# EAGLE design ATJ3315Recorder (EAGLE 6.5.0)
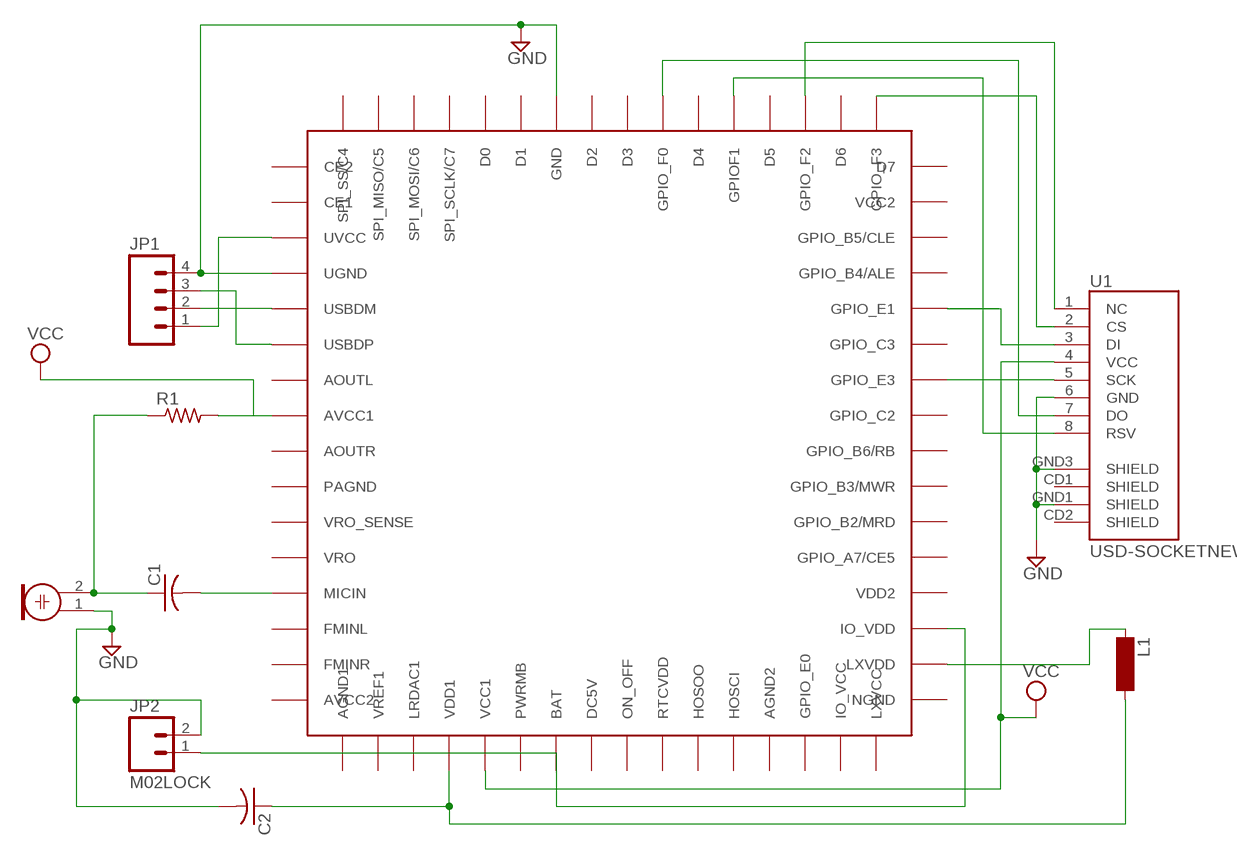
[diagram p0: schematic, sheet 1]

## Parts
C1  C-USC0201  [C0201]
C2  C-USC0201  [C0201]
JP1  M04PTH  [1X04]
JP2  M02LOCK  [1X02_LOCK]
L1  SM-1206  [SM-1206]
M1  ELECTRET_MICROPHON-WM-61A  [WM-61A]
R1  R-US_M0805  [M0805]
U1  USD-SOCKETNEW  [MICRO-SD-SOCKET-PP]
U$4  AJ3315  [64M1]

## Nets
GND: C2.2 JP1.4 JP2.2 M1.1 U1.6(GND) U1.GND1(SHIELD) U1.GND3(SHIELD) U$4.4(UGND) U$4.58(GND)
N$1: JP1.2 U$4.5(USBDM)
N$2: JP1.3 U$4.6(USBDP)
N$3: JP2.1 U$4.23(BAT) U$4.35(IO_VDD)
N$4: JP1.1 U$4.3(UVCC)
N$5: R1.2 U$4.8(AVCC1)
N$6: C1.1 M1.2 R1.1
N$7: C1.2 U$4.13(MICIN)
N$8: U1.5(SCK) U$4.42(GPIO_E3)
N$9: U1.7(DO) U$4.55(GPIO_F0)
N$10: U1.1(NC) U$4.51(GPIO_F2)
N$11: U1.2(CS) U$4.49(GPIO_F3)
N$12: U1.3(DI) U$4.44(GPIO_E1)
N$13: U1.8(RSV) U$4.53(GPIOF1)
N$14: L1.1 U$4.34(LXVDD)
N$16: C2.1 L1.2 U$4.20(VDD1)
VCC: U1.4(VCC) U$4.21(VCC1)
Unconnected: U1.CD1(SHIELD) U1.CD2(SHIELD) U$4.1(CE2) U$4.2(CE1) U$4.7(AOUTL) U$4.9(AOUTR) U$4.10(PAGND) U$4.11(VRO_SENSE) U$4.12(VRO) U$4.14(FMINL) U$4.15(FMINR) U$4.16(AVCC2) U$4.17(AGND1) U$4.18(VREF1) U$4.19(LRDAC1) U$4.22(PWRMB) U$4.24(DC5V) U$4.25(ON_OFF) U$4.26(RTCVDD) U$4.27(HOSOO) U$4.28(HOSCI) U$4.29(AGND2) U$4.30(GPIO_E0) U$4.31(IO_VCC) U$4.32(LXVCC) U$4.33(NGND) U$4.36(VDD2) U$4.37(GPIO_A7/CE5) U$4.38(GPIO_B2/MRD) U$4.39(GPIO_B3/MWR) U$4.40(GPIO_B6/RB) U$4.41(GPIO_C2) U$4.43(GPIO_C3) U$4.45(GPIO_B4/ALE) U$4.46(GPIO_B5/CLE) U$4.47(VCC2) U$4.48(D7) U$4.50(D6) U$4.52(D5) U$4.54(D4) U$4.56(D3) U$4.57(D2) U$4.59(D1) U$4.60(D0) U$4.61(SPI_SCLK/C7) U$4.62(SPI_MOSI/C6) U$4.63(SPI_MISO/C5) U$4.64(SPI_SS/C4)

## Library data of the parts
C1 C2 = rcl:C-US: CAPACITOR, American symbol
JP1 = SparkFun-Connectors:M04: Header 4 Standard 4-pin 0.1" header. Use with straight break away headers (SKU : PRT-00116), right angle break away headers (PRT-00553), swiss pins (PRT-00743), machine pins (PRT-00117), and female headers (PRT-00115). Molex polarized connector foot print use with SKU : PRT-08231 with associated crimp pins and housings. 1MM SMD Version SKU: PRT-10208
JP2 = SparkFun-Connectors:M02: Standard 2-pin 0.1" header. Use with - straight break away headers ( PRT-00116) - right angle break away headers (PRT-00553) - swiss pins (PRT-00743) - machine pins (PRT-00117) - female headers (PRT-00115) Molex polarized connector foot print use with: PRT-08233 with associated crimp pins and housings. 2.54_SCREWTERM for use with PRT-10571. 3.5mm Screw Terminal footprints for PRT-08084 5mm Screw Terminal footprints for use with PRT-08433
L1 = inductor-neosid:SM-1206: INDUCTOR SMD chip inductor; OC_FARNELL: unknown; OC_NEWARK: unknown
M1 = microphon:ELECTRET_MICROPHON-: Electret Condenser Microphone
R1 = rcl:R-US_: RESISTOR, American symbol
U1 = SparkFun-Connectors:USD-SOCKET: microSD Socket Push-push type uSD socket. Schematic element and footprint production proven. Spark Fun Electronics SKU : PRT-00127. tDoc lines correctly indicate media card edge positions when inserting (unlocked, locked, depressed).
U$4 = dissection:AJ3315

## Board
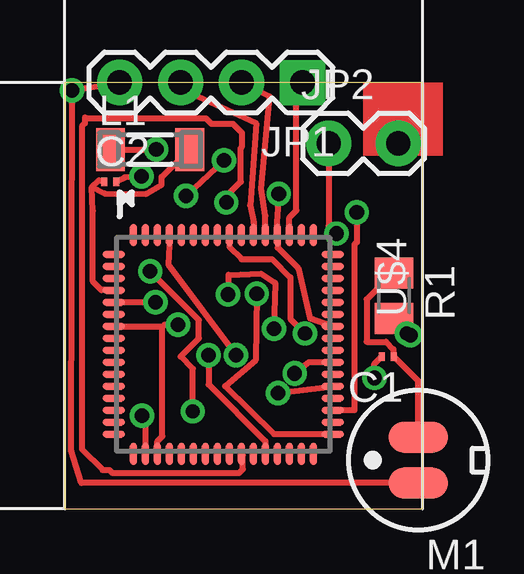
[diagram p1: board, top side]
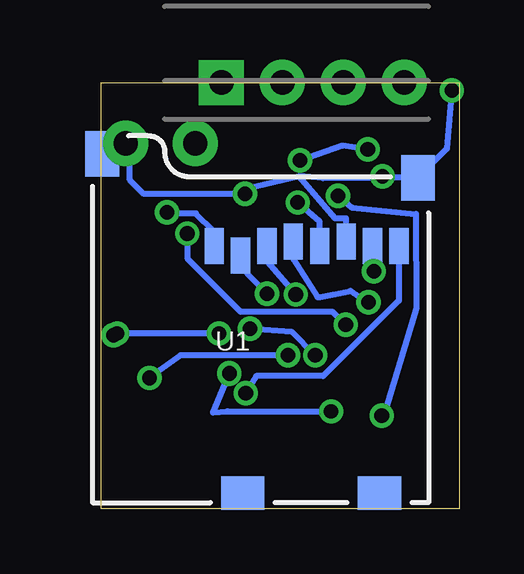
[diagram p2: board, bottom side, seen from below]

Size 14.91 x 17.77 mm. Coordinates in mm from the lower left corner, seen from the top.
Outline: 0,0 14.91,0 14.91,17.77 0,17.77 0,0
Copper layers (1*16): Top 0.035mm / dielectric 1.5mm / Bottom 0.035mm
Design rules "default *": minimum track width 10mil, minimum drill 24mil, track to track 1mil, track to pad 1mil, pad to pad 1mil, via to via 1mil, smd to smd 1mil, copper to edge 40mil, drill to drill 8mil, minimum pad ring 10mil, minimum via ring 8mil, stop-mask expansion 4mil, vias tented up to drill 0mil, thermal gap 10mil

### Footprints (pad centres in the part's own frame; a part is rotated, then mirrored left to right if it is on the bottom)
C0201 = smd 0.25 x 0.35: 1 -0.25,0; 2 0.25,0
1X04 = drill 1.016 pad 1.88 square: 1 0,0 | drill 1.016 pad 1.88: 2 2.54,0; 3 5.08,0; 4 7.62,0
1X02_LOCK = drill 1.016 pad 1.88: 1 -0.178,0; 2 2.718,0
SM-1206 = smd 1.2 x 1.8: 1 -1.65,0; 2 1.65,0
WM-61A = smd 2.5 x 1.3: 1 0,0.95; 2 0,-0.95
M0805 = smd 1.3 x 1.6: 1 -0.95,0; 2 0.95,0
MICRO-SD-SOCKET-PP = smd 0.8 x 1.5: 1 -8.94,10.7; 2 -7.84,10.3; 3 -6.74,10.7; 4 -5.64,10.9; 5 -4.54,10.7; 6 -3.44,10.9; 7 -2.34,10.7; 8 -1.24,10.7 | smd 1.8 x 1.4: CD1 -2.05,0.4; CD2 -7.75,0.4 | smd 1.4 x 1.9: GND1 -13.6,14.55; GND3 -0.45,13.55
64M1 = smd 0.95 x 0.3: 1 -4.56,3.75; 2 -4.56,3.25; 3 -4.56,2.75; 4 -4.56,2.25; 5 -4.56,1.75; 6 -4.56,1.25; 7 -4.56,0.75; 8 -4.56,0.25; 9 -4.56,-0.25; 10 -4.56,-0.75; 11 -4.56,-1.25; 12 -4.56,-1.75; 13 -4.56,-2.25; 14 -4.56,-2.75; 15 -4.56,-3.25; 16 -4.56,-3.75; 33 4.56,-3.75; 34 4.56,-3.25; 35 4.56,-2.75; 36 4.56,-2.25; 37 4.56,-1.75; 38 4.56,-1.25; 39 4.56,-0.75; 40 4.56,-0.25; 41 4.56,0.25; 42 4.56,0.75; 43 4.56,1.25; 44 4.56,1.75; 45 4.56,2.25; 46 4.56,2.75; 47 4.56,3.25; 48 4.56,3.75 | smd 0.3 x 0.95: 17 -3.75,-4.56; 18 -3.25,-4.56; 19 -2.75,-4.56; 20 -2.25,-4.56; 21 -1.75,-4.56; 22 -1.25,-4.56; 23 -0.75,-4.56; 24 -0.25,-4.56; 25 0.25,-4.56; 26 0.75,-4.56; 27 1.25,-4.56; 28 1.75,-4.56; 29 2.25,-4.56; 30 2.75,-4.56; 31 3.25,-4.56; 32 3.75,-4.56; 49 3.75,4.56; 50 3.25,4.56; 51 2.75,4.56; 52 2.25,4.56; 53 1.75,4.56; 54 1.25,4.56; 55 0.75,4.56; 56 0.25,4.56; 57 -0.25,4.56; 58 -0.75,4.56; 59 -1.25,4.56; 60 -1.75,4.56; 61 -2.25,4.56; 62 -2.75,4.56; 63 -3.25,4.56; 64 -3.75,4.56

### Placement (x,y rotation side)
C1  13.46,6.35 180 top
C2  1.91,13.64 0 top
JP1  9.91,17.78 180 top
JP2  11.18,15.24 0 top
L1  3.56,14.99 0 top
M1  14.73,2.03 180 top
R1  13.72,8.89 270 top
U1  1.27,0.25 0 bottom
U$4  6.6,6.86 270 top

### Tracks (layer width: path | path; a pad name or v marks a point on that pad's centre or on a via)
GND  (via drill 0.6 pad 0.25, 0.61)
  Top 0.254: U$4.58 11.15,7.62 10.21,7.95 9.73,10.03 8.87,10.9 8.87,11.4 U$4.4 8.84,11.53 8.84,11.94 v8.91,13.13 | v3.2,13.87 2.49,13.82 C2.2 | M1.1 0.7,1.08 0.28,2.41 v0.31,17.45 JP1.4
  Bottom 0.254: 6.68,13.87 5.18,12.12 4.72,12.12 4.72,11.18 U1.6 | 6.68,13.87 5.66,13.79 3.3,13.79 v3.2,13.87 3.15,13.82 1.73,13.82 U1.GND3 0.51,15.02 v0.31,17.45 | 6.68,13.87 8.81,13.39 v8.91,13.13 13.13,13.13 13.72,13.72 13.72,15.06 JP2.2 14.43,15.24 U1.GND1
N$1
  Top 0.254: U$4.5 8.35,12.22 8.18,13.36 8.53,17.2 JP1.2
N$2
  Top 0.254: JP1.3 4.83,17.53 7.98,16.08 7.72,12.65 7.87,11.94 7.87,11.44 U$4.6
N$3  (via drill 0.61)
  Top 0.254: 4.06,7.59 2.06,7.59 U$4.23 | 4.06,7.59 4.06,3.02 3.86,2.82 3.86,2.31 U$4.35 | v4.72,7.67 4.17,7.67 4.06,7.59 | v11.33,11.48 11,11.81 JP2.1
  Bottom 0.254: v4.72,7.67 5.28,8.23 9.12,8.23 11.33,10.44 v11.33,11.48
N$4
  Top 0.254: U$4.3 9.35,12.15 9.65,12.45 9.65,17.53 JP1.1
N$5  (via drill 0.6 pad 0.25)
  Top 0.254: U$4.8 6.85,10.93 7.37,10.41 8.64,10.41 9.4,9.65 9.4,7.92 v10.01,7.32 | v14.4,7.24 14.4,7.25 R1.2
  Bottom 0.254: v10.01,7.32 14.33,7.32 v14.4,7.24
N$6
  Top 0.254: R1.1 13.66,9.83 12.57,8.74 12.57,6.96 13.39,6.96 13.69,6.66 13.69,6.35 C1.1 14.73,5.33 M1.2
N$7  (via drill 0.61)
  Top 0.254: v12.9,5.46 12.9,6.04 C1.2 | v7.14,6.4 4.32,10.19 4.37,11.4 U$4.13
  Bottom 0.254: v12.9,5.46 11.61,6.4 v7.14,6.4
N$8  (via drill 0.6 pad 0.25)
  Top 0.254: v6.73,12.78 6.53,12.83 7.34,13.64 7.34,15.06 7.39,15.11 7.39,15.67 7.01,16.05 6.12,16.05 5.89,16.28 0.89,16.28 0.84,16.33 0.84,16.08 0.71,15.95 0.71,2.49 1.58,1.63 1.85,1.63 1.98,1.5 7.26,1.5 7.42,1.65 7.42,2.23 U$4.42
  Bottom 0.254: U1.5 5.81,11.98 v6.73,12.78
N$9  (via drill 0.6 pad 0.25)
  Top 0.254: U$4.55 10.17,6.11 v9.58,5.66 | v5.33,4.06 5.33,5.84 4.83,6.35 5.59,7.11 5.59,7.87 v3.56,9.91
  Bottom 0.254: v9.58,5.66 10.26,4.01 9.65,4.06 v5.33,4.06 | v3.56,9.91 3.56,10.9 U1.7
N$10  (via drill 0.61)
  Top 0.254: v12.17,12.37 12.17,11.12 12.06,11.02 12.06,4.12 U$4.51
  Bottom 0.254: v12.17,12.37 12.12,12.32 10.97,12.32 10.21,11.56 10.21,10.97 U1.1
N$11  (via drill 0.61)
  Top 0.254: v8,8.97 7.95,6.2 6.68,5.11 8.71,3.12 11.15,3.12 U$4.49
  Bottom 0.254: v8,8.97 9.09,10.11 9.09,10.54 U1.2
N$12  (via drill 0.61)
  Top 0.254: v5.99,6.4 5.99,5.18 8.36,2.82 8.36,2.31 U$4.44 | v8.71,7.52 8.76,9.42 8.18,9.8 6.83,9.75 v6.81,8.94
  Bottom 0.254: v5.99,6.4 6.99,7.39 v8.71,7.52 | v6.81,8.94 8,10.31 U1.3
N$13  (via drill 0.61)
  Top 0.254: v8.89,4.83 11.15,5.11 U$4.53
  Bottom 0.254: v8.89,4.83 8.46,5.54 5.66,5.54 2.52,8.69 U1.8
N$14  (via drill 0.61)
  Top 0.254: v3.23,3.89 3.35,4.01 3.35,2.31 U$4.34 | v6.63,14.53 v5.05,13.06 | L1.1 v3.81,14.99
  Bottom 0.254: v3.23,3.89 3.23,3.61 1.78,8.36 1.8,12.29 4.47,12.57 v5.05,13.06 | v6.63,14.53 4.85,15.14 v3.81,14.99
N$15  (via drill 0.6 pad 0.25)
  other vias: 9.58,5.64
N$16
  Top 0.254: 1.13,13.42 1.17,12.42 1.17,9.47 1.52,9.12 2.03,9.12 U$4.20 | 1.13,13.42 1.42,13.69 C2.1 | L1.2 5.18,14.99 4.04,13.84 4.04,13.51 3.38,13.13 1.65,13.16 1.13,13.42
N$17  (via drill 0.6 pad 0.25)
  other vias: 3.56,9.91
N$20  (via drill 0.6 pad 0.25)
  other vias: 14.25,7.32
N$21  (via drill 0.6 pad 0.25)
  other vias: 6.73,12.78
VCC  (via drill 0.61)
  Top 0.254: v3.79,8.61 U$4.21
  Bottom 0.254: v3.79,8.61 4.52,9.09 5.89,8.81 6.91,10.41 U1.4
(copper drawn outside any net)
  shapes: Top area x1